# Altium schematic sheet DC-Motor-DRV.SchDoc: DC Motor Driver
size OrCAD A; DocumentNumber: LM-004; Revision: B; SheetNumber: 1; SheetTotal: 4
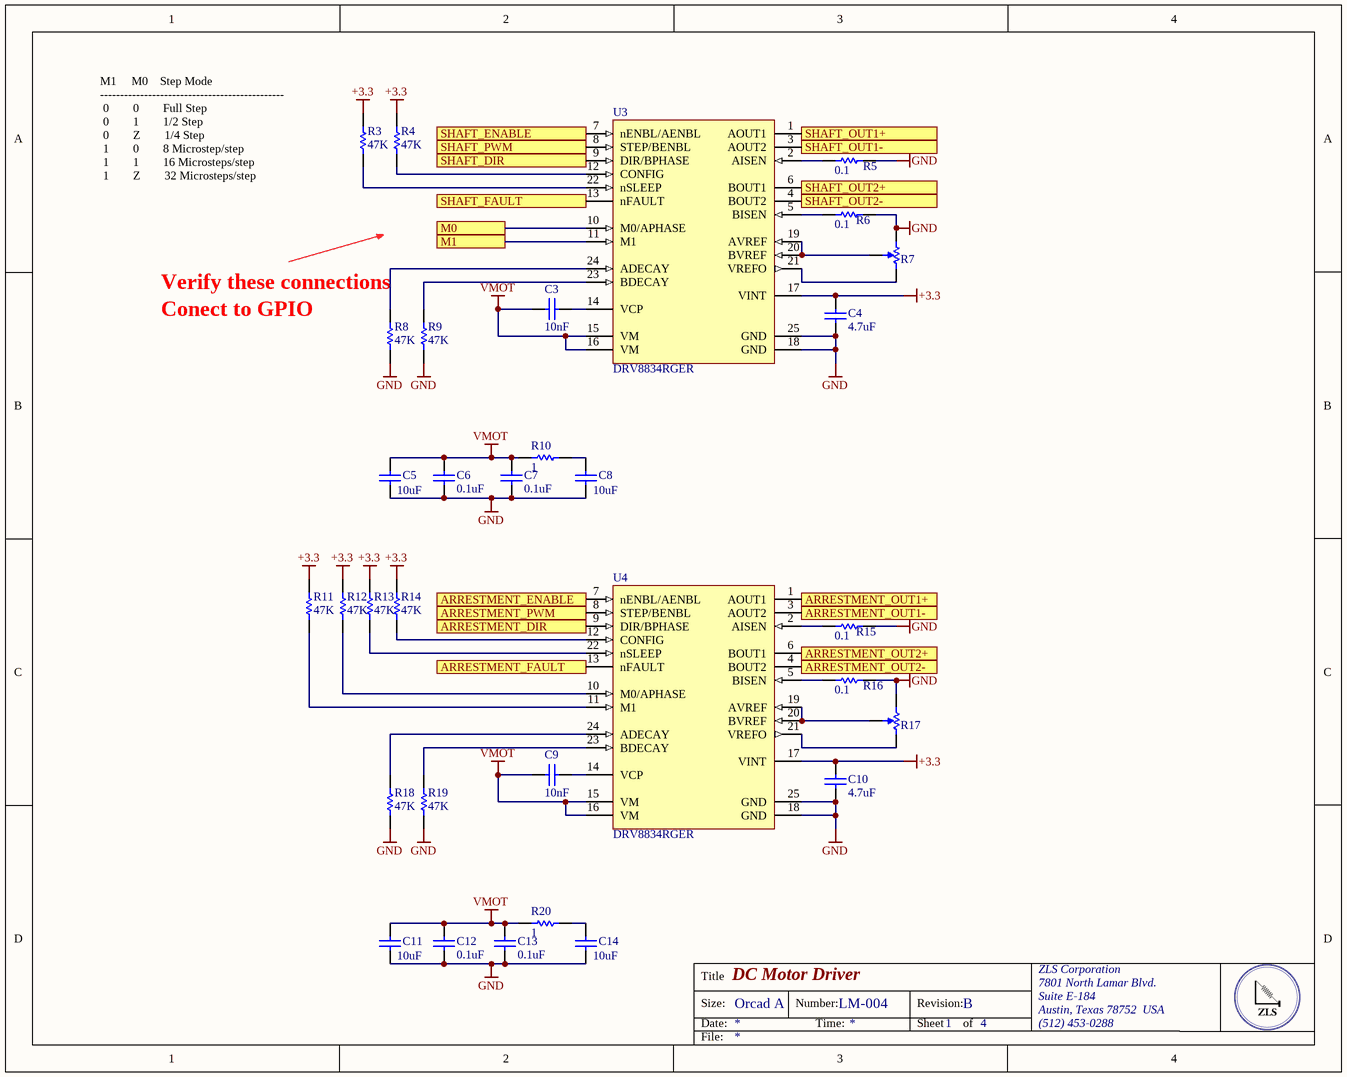
[diagram p0: DC-Motor-DRV.SchDoc]

## Parts
C3  10nF  [CAPC0603(1608)100_L]
C4  4.7uF  [CAPC0603(1608)55_M]
C5  10uF  [CAPC0805(2012)145_N]
C6  0.1uF  [CAPC1608X94X35LL15T15]
C7  0.1uF  [CAPC1608X94X35LL15T15]
C8  10uF  [CAPC0805(2012)145_N]
C9  10nF  [CAPC0603(1608)100_L]
C10  4.7uF  [CAPC0603(1608)55_M]
C11  10uF  [CAPC0805(2012)145_N]
C12  0.1uF  [CAPC1608X94X35LL15T15]
C13  0.1uF  [CAPC1608X94X35LL15T15]
C14  10uF  [CAPC0805(2012)145_N]
R3  47K  [RESC0603(1608)_N]
R4  47K  [RESC0603(1608)_N]
R5  0.1  [RESC0603(1608)_N]
R6  0.1  [RESC0603(1608)_N]
R7  3313J-1-503E  [BOUR-3313J-1_V]  (value not drawn)
R8  47K  [RESC0603(1608)_N]
R9  47K  [RESC0603(1608)_N]
R10  1  [RESC0603(1608)_N]
R11  47K  [RESC0603(1608)_N]
R12  47K  [RESC0603(1608)_N]
R13  47K  [RESC0603(1608)_N]
R14  47K  [RESC0603(1608)_N]
R15  0.1  [RESC0603(1608)_N]
R16  0.1  [RESC0603(1608)_N]
R17  3313J-1-503E  [BOUR-3313J-1_V]  (value not drawn)
R18  47K  [RESC0603(1608)_N]
R19  47K  [RESC0603(1608)_N]
R20  1  [RESC0603(1608)_N]
U3  DRV8834RGER  [RGE0024B_V]
U4  DRV8834RGER  [RGE0024B_V]

## Ports
ARRESTMENT_DIR, ARRESTMENT_ENABLE, ARRESTMENT_FAULT, ARRESTMENT_OUT1+, ARRESTMENT_OUT1-, ARRESTMENT_OUT2+, ARRESTMENT_OUT2-, ARRESTMENT_PWM, M0, M1, SHAFT_DIR, SHAFT_ENABLE, SHAFT_FAULT, SHAFT_OUT1+, SHAFT_OUT1-, SHAFT_OUT2+, SHAFT_OUT2-, SHAFT_PWM

## Nets
+3.3: C4.2 C10.2 R3.2 R4.2 R11.2 R12.2 R13.2 R14.2 U3.17(VINT) U4.17(VINT)
GND: C4.1 C5.1 C6.2 C7.2 C8.1 C10.1 C11.1 C12.2 C13.2 C14.1 R5.2 R6.2 R7.1 R8.1 R9.1 R15.2 R16.2 R17.1 R18.1 R19.1 U3.18(GND) U3.25(GND) U4.18(GND) U4.25(GND)
VMOT: C3.1 C5.2 C6.1 C7.1 C9.1 C11.2 C12.1 C13.1 R10.2 R20.2 U3.15(VM) U3.16(VM) U4.15(VM) U4.16(VM)
ARRESTMENT_DIR: U4.9(DIR/BPHASE) ; port ARRESTMENT_DIR
ARRESTMENT_ENABLE: U4.7(nENBL/AENBL) ; port ARRESTMENT_ENABLE
ARRESTMENT_FAULT: U4.13(nFAULT) ; port ARRESTMENT_FAULT
ARRESTMENT_OUT1+: U4.1(AOUT1) ; port ARRESTMENT_OUT1+
ARRESTMENT_OUT1-: U4.3(AOUT2) ; port ARRESTMENT_OUT1-
ARRESTMENT_OUT2+: U4.6(BOUT1) ; port ARRESTMENT_OUT2+
ARRESTMENT_OUT2-: U4.4(BOUT2) ; port ARRESTMENT_OUT2-
ARRESTMENT_PWM: U4.8(STEP/BENBL) ; port ARRESTMENT_PWM
M0: U3.10(M0/APHASE) ; port M0
M1: U3.11(M1) ; port M1
SHAFT_DIR: U3.9(DIR/BPHASE) ; port SHAFT_DIR
SHAFT_ENABLE: U3.7(nENBL/AENBL) ; port SHAFT_ENABLE
SHAFT_FAULT: U3.13(nFAULT) ; port SHAFT_FAULT
SHAFT_OUT1+: U3.1(AOUT1) ; port SHAFT_OUT1+
SHAFT_OUT1-: U3.3(AOUT2) ; port SHAFT_OUT1-
SHAFT_OUT2+: U3.6(BOUT1) ; port SHAFT_OUT2+
SHAFT_OUT2-: U3.4(BOUT2) ; port SHAFT_OUT2-
SHAFT_PWM: U3.8(STEP/BENBL) ; port SHAFT_PWM
NetC3_2: C3.2 U3.14(VCP)
NetC8_2: C8.2 R10.1
NetC9_2: C9.2 U4.14(VCP)
NetC14_2: C14.2 R20.1
NetR3_1: R3.1 U3.22(nSLEEP)
NetR4_1: R4.1 U3.12(CONFIG)
NetR5_1: R5.1 U3.2(AISEN)
NetR6_1: R6.1 U3.5(BISEN)
NetR7_2: R7.2 U3.19(AVREF) U3.20(BVREF)
NetR7_3: R7.3 U3.21(VREFO)
NetR8_2: R8.2 U3.24(ADECAY)
NetR9_2: R9.2 U3.23(BDECAY)
NetR11_1: R11.1 U4.11(M1)
NetR12_1: R12.1 U4.10(M0/APHASE)
NetR13_1: R13.1 U4.22(nSLEEP)
NetR14_1: R14.1 U4.12(CONFIG)
NetR15_1: R15.1 U4.2(AISEN)
NetR16_1: R16.1 U4.5(BISEN)
NetR17_2: R17.2 U4.19(AVREF) U4.20(BVREF)
NetR17_3: R17.3 U4.21(VREFO)
NetR18_2: R18.2 U4.24(ADECAY)
NetR19_2: R19.2 U4.23(BDECAY)

## Notes on the sheet
- M1     M0    Step Mode
  ----------------------------------------------
  0        0        Full Step
  0        1        1/2 Step
  0        Z        1/4 Step
  1        0        8 Microstep/step
  1        1        16 Microsteps/step
  1        Z        32 Microsteps/step
- Verify these connections
- Conect to GPIO
- Title
- Size:
- Date:
- Orcad A
- Number:
- Time:
- Revision:
- Sheet
- of
- ZLS Corporation
- 7801 North Lamar Blvd.
- Suite E-184
- Austin, Texas 78752  USA
- (512) 453-0288
- File:

## Library data of the parts
C3 C9 = CMP-1035-02312-1: CAP 10nF 16V ±20% 0603 (1608 Metric) Thickness 1mm SMD; Manufacturer: Kyocera AVX; Manufacturer Part Number: 0603YC103KAT2A; Case-EIA: 0603; Tolerance: Â±20%; Case-Metric: 1608; Dielectric: X7R; Dissipation Factor: 3.5%; Max Thickness: 1 mm; Value: 10nF; Technology: SMT; Rated Voltage: 16 V; Supplier 1: Digi-Key; Supplier Part Number 1: 478-6209-6-ND; Stock 1: 132527; Pricing 1: 1=0.19, 10=0.133, 100=0.0625, 500=0.04384, 1000=0.0363 (USD); Mount: Surface Mount; Case/Package: 0603; Case Code (Metric): 1608; Case Code (Imperial): 0603; Min Operating Temperature: -55°C; Max Operating Temperature: 125°C; Capacitance: 10nF; Packaging: Tape and Reel; Voltage Rating (DC): 16V; Voltage Rating: 16V; Package Quantity: 1; Termination: SMD/SMT; Voltage: 16V; Length: 1.6mm; Width: 0.032inch; Thickness: 0.035inch; Depth: 0.81mm; Radiation Hardening: No; REACH SVHC: No SVHC; Lead Free: Lead Free; ComponentLink1URL: http://catalogs.avx.com/SurfaceMount.pdf; ComponentLink1Description: http://catalogs.avx.com/SurfaceMount.pdf; ComponentLink2URL: http://www.farnell.com/datasheets/1679506.pdf; ComponentLink2Description: http://www.farnell.com/datasheets/1679506.pdf; ComponentLink3URL: http://www.mouser.com/ds/2/40/X7RDielectric-777024.pdf; ComponentLink3Description: http://www.mouser.com/ds/2/40/X7RDielectric-777024.pdf; ComponentLink4URL: http://www.avx.com/docs/Catalogs/cx7r.pdf; ComponentLink4Description: http://www.avx.com/docs/Catalogs/cx7r.pdf
C4 C10 = CMP-1035-02779-1: CAP 4.7uF 6.3V ±10% 0603 (1608 Metric) Thickness 0.55mm SMD; Manufacturer: KEMET; Manufacturer Part Number: C0603C475K9PACTU; Case-EIA: 0603; Tolerance: Â±10%; Case-Metric: 1608; Dielectric Material: Ceramic; Dielectric: X5R; Dissipation Factor: 5%; Technology: SMT; Value: 4.7uF; Max Thickness: 0.55 mm; Rated Voltage: 6.3 V; Supplier 1: Digi-Key; Supplier Part Number 1: 399-3482-6-ND; Stock 1: 1765509; Pricing 1: 1=0.21, 10=0.15, 100=0.0706, 500=0.04952, 1000=0.041 (USD); Mount: PCB,Surface Mount; Case/Package: 0603; Number of Pins: 2; Case Code (Metric): 1608; Case Code (Imperial): 0603; Contact Plating: Matte,Tin; Min Operating Temperature: -55°C; Max Operating Temperature: 85°C; Package Quantity: 1; Capacitance: 4.7uF; Voltage Rating: 6.3V; Packaging: Tape and Reel; Termination: SMD/SMT; Voltage Rating (DC): 6.3V; Voltage: 6.3V; Length: 1.6mm; Height: 0.8mm; Width: 0.031inch; Thickness: 0.035inch; Depth: 0.8mm; Lead Pitch: 0.7mm; Radiation Hardening: No; Lead Free: Lead Free; REACH SVHC: No SVHC; ComponentLink1URL: https://api.kemet.com/component-edge/download/datasheet/C0603C475K9PACTU.pdf; ComponentLink1Description: https://api.kemet.com/component-edge/download/datasheet/C0603C475K9PACTU.pdf; ComponentLink2URL: http://www.farnell.com/datasheets/1732700.pdf; ComponentLink2Description: http://www.farnell.com/datasheets/1732700.pdf; ComponentLink3URL: http://www.farnell.com/datasheets/1789732.pdf; ComponentLink3Description: http://www.farnell.com/datasheets/1789732.pdf; ComponentLink4URL: http://www.farnell.com/datasheets/40889.pdf; ComponentLink4Description: http://www.farnell.com/datasheets/40889.pdf
C5 C8 C11 C14 = CMP-1036-04795-1: CAP CER 0.1UF 25V X7R 0805; Manufacturer: Murata Electronics North America; Manufacturer Part Number: GRM21BR71E104KA01L; Capacitance: 0.1µF; Tolerance: ±10%; Supplier 1: Digi-Key; Supplier Part Number 1: 490-1673-6-ND; RoHS: RoHS Compliant; Category: Capacitors; Stock 1: 891652; Pricing 1: 1=0.2, 10=0.145, 100=0.0683, 500=0.04788, 1000=0.03964 (USD); Packaging: Digi-Reel®; Part Status: Active; Voltage - Rated: 25V; Temperature Coefficient: X7R; Operating Temperature: -55°C ~ 125°C; Features: -; Ratings: -; Applications: General Purpose; Mounting Type: Surface Mount, MLCC; Package / Case: 0805 (2012 Metric); Size / Dimension: 0.079" L x 0.049" W (2.00mm x 1.25mm); Height - Seated (Max): -; Thickness (Max): 0.053" (1.35mm); Lead Spacing: -; Lead Style: -; ComponentLink1URL: http://www.murata.com/~/media/webrenewal/support/library/catalog/products/capacitor/mlcc/c02e.ashx; ComponentLink1Description: http://www.murata.com/~/media/webrenewal/support/library/catalog/products/capacitor/mlcc/c02e.ashx
C6 C7 C12 C13 = CMP-1661-00001-2: CAP .1UF 16V CERAMIC X7R 0603; Manufacturer: Yageo; Manufacturer Part Number: CC0603KRX7R7BB105; Capacitance: 1uF; Tolerance: 10%; Dissipation Factor: 5%; ComponentLink1Description: Datasheet; ComponentLink1URL: http://datasheets.avx.com/X7RDielectric.pdf; Supplier 1: Digi-Key; Supplier Part Number 1: 311-1446-6-ND; Stock 1: 5506121; Pricing 1: 1=0.21, 10=0.143, 100=0.0727, 500=0.04974, 1000=0.044 (USD); Mount: Surface Mount; Case/Package: 0603; Number of Pins: 2; Case Code (Metric): 1608; Case Code (Imperial): 0603; Min Operating Temperature: -55°C; Max Operating Temperature: 125°C; Voltage Rating: 16V; Package Quantity: 1; Packaging: Tape and Reel; Voltage Rating (DC): 16V; Dielectric: X7R; Termination: SMD/SMT; Voltage: 16V; Composition: Ceramic; Length: 1.6mm; Height: 0.8mm; Width: 0.031inch; Thickness: 0.035inch; Depth: 0.8mm; Radiation Hardening: No; REACH SVHC: Unknown; Lead Free: Lead Free; Halogen Free: Halogen Free; ComponentLink2URL: http://www.yageo.com/documents/recent/UPY-GPHC_X7R_6.3V-to-50V_18.pdf; ComponentLink2Description: http://www.yageo.com/documents/recent/UPY-GPHC_X7R_6.3V-to-50V_18.pdf; ComponentLink3URL: http://www.yageo.com/documents/recent/UPY-GPHC_X7R_6.3V-to-50V_8.pdf; ComponentLink3Description: http://www.yageo.com/documents/recent/UPY-GPHC_X7R_6.3V-to-50V_8.pdf; ComponentLink4URL: http://www.farnell.com/datasheets/1734573.pdf; ComponentLink4Description: http://www.farnell.com/datasheets/1734573.pdf; ComponentLink5URL: http://www.farnell.com/datasheets/1489800.pdf; ComponentLink5Description: http://www.farnell.com/datasheets/1489800.pdf
R3 R4 R8 R9 R11-R14 R18 R19 = CMP-1012-00511-1: RES SMD 10K OHM 1% 1/10W 0603; Manufacturer: Vishay; Manufacturer Part Number: CRCW060310K0FKEA; Resistance: 10kR; Power Rating: 100mW; Voltage Rating: 75V; Temperature Coefficient: 100ppm/°C; ComponentLink1URL: http://www.vishay.com/docs/20008/dcrcw.pdf; ComponentLink1Description: http://www.vishay.com/docs/20008/dcrcw.pdf; ComponentLink2URL: https://www.verical.com/server-webapp/html/getDatasheet?partID=86831; ComponentLink2Description: https://www.verical.com/server-webapp/html/getDatasheet?partID=86831; ComponentLink3URL: http://www.farnell.com/datasheets/2310790.pdf; ComponentLink3Description: http://www.farnell.com/datasheets/2310790.pdf; ComponentLink4URL: http://www.vishay.com/docs/20035/dcrcwe3.pdf; ComponentLink4Description: http://www.vishay.com/docs/20035/dcrcwe3.pdf; ComponentLink5URL: http://www.farnell.com/datasheets/2111203.pdf; ComponentLink5Description: http://www.farnell.com/datasheets/2111203.pdf; ComponentLink6URL: http://uk.rs-online.com/webdocs/0d98/0900766b80d98afc.pdf; ComponentLink6Description: http://uk.rs-online.com/webdocs/0d98/0900766b80d98afc.pdf; Supplier 1: Digi-Key; Supplier Part Number 1: 311-0.0GRDKR-ND; Stock 1: 49641653; Pricing 1: 1=0.1, 10=0.021, 25=0.0152, 50=0.0114, 100=0.0084, 250=0.00644, 500=0.00514, 1000=0.00379 (USD); Case/Package: 0603; Number of Pins: 2; Weight: 7.1E-05oz; Case Code (Metric): 1608; Case Code (Imperial): 0603; Contact Plating: Lead,Tin; Min Operating Temperature: -55°C; Max Operating Temperature: 155°C; Tolerance: 1%; Packaging: Tape and Reel; Composition: Thick Film; Termination: SMD/SMT; Military Standard: Not; Voltage Rating (DC): 75V; Package Quantity: 10; Number of Terminations: 2; Max Power Dissipation: 100mW; Features: Automotive AEC-Q200; Length: 1.55mm; Height: 0.45mm; Depth: 0.85mm; Width: 0.033inch; Radiation Hardening: No; REACH SVHC: Unknown; Lead Free: Lead Free
R5 R6 R15 R16 = CMP-1012-00511-1: 0R12 0.1W 1% 0603 (1608 Metric)  SMD; Manufacturer: Vishay; Manufacturer Part Number: CRCW060310K0FKEA; Value: 1020.00 Ohm; Case-EIA: 0603; Case-Metric: 1608; Resistance: 10kR; Power Rating: 100mW; Voltage Rating: 75V; Temperature Coefficient: 100ppm/°C; Technology: SMT; Power: 0.1 W; Tolerance: 1 %; Supplier 1: Digi-Key; Supplier Part Number 1: 311-0.0GRDKR-ND; Stock 1: 49641653; Pricing 1: 1=0.1, 10=0.021, 25=0.0152, 50=0.0114, 100=0.0084, 250=0.00644, 500=0.00514, 1000=0.00379 (USD); Case/Package: 0603; Number of Pins: 2; Weight: 7.1E-05oz; Case Code (Metric): 1608; Case Code (Imperial): 0603; Contact Plating: Lead,Tin; Min Operating Temperature: -55°C; Max Operating Temperature: 155°C; Packaging: Tape and Reel; Package Quantity: 10; Composition: Thick Film; Military Standard: Not; Termination: SMD/SMT; Voltage Rating (DC): 75V; Number of Terminations: 2; Max Power Dissipation: 100mW; Features: Automotive AEC-Q200; Length: 1.55mm; Height: 0.45mm; Width: 0.033inch; Depth: 0.85mm; Radiation Hardening: No; REACH SVHC: Unknown; Lead Free: Lead Free; ComponentLink1URL: http://www.vishay.com/docs/20008/dcrcw.pdf; ComponentLink1Description: http://www.vishay.com/docs/20008/dcrcw.pdf; ComponentLink2URL: https://www.verical.com/server-webapp/html/getDatasheet?partID=86831; ComponentLink2Description: https://www.verical.com/server-webapp/html/getDatasheet?partID=86831; ComponentLink3URL: http://www.farnell.com/datasheets/2310790.pdf; ComponentLink3Description: http://www.farnell.com/datasheets/2310790.pdf; ComponentLink4URL: http://www.vishay.com/docs/20035/dcrcwe3.pdf; ComponentLink4Description: http://www.vishay.com/docs/20035/dcrcwe3.pdf; ComponentLink5URL: http://www.farnell.com/datasheets/2111203.pdf; ComponentLink5Description: http://www.farnell.com/datasheets/2111203.pdf; ComponentLink6URL: http://uk.rs-online.com/webdocs/0d98/0900766b80d98afc.pdf; ComponentLink6Description: http://uk.rs-online.com/webdocs/0d98/0900766b80d98afc.pdf
R7 R17 = CMP-2000-05588-1: 3 mm Trimpot(R) Trimming Potentiometer, 50 KOhm, +/- 20%, 0.125 W, -55 to 125 degC, 3-Pin SMD, RoHS, Tape and Reel; Manufacturer: Bourns; SVHC: NoSVHC(19-Dec-2012); Temperature Coefficient: ±150ppm/°C; No. of Turns: 1; Power Rating: 125mW; Track Resistance: 50kohm; Manufacturer URL: http://www.bourns.com/; Potentiometer Mounting: SMD; Package Description: 3-Pin Surface Mount Device, Body 3.5 x 3.2 mm, Pitch 1.15 mm; Package Reference: 3313J-1; Mounting Technology: SurfaceMount; Resistance Tolerance: ±20%; Datasheet Version: 05/2016; Datasheet URL: http://www.bourns.com/docs/Product-Datasheets/3313.pdf
R10 R20 = CMP-1012-00511-1: RES SMD 1 OHM 1% 1/10W 0603; Manufacturer: Vishay Dale; Manufacturer Part Number: CRCW06031R00FKEA; Resistance: 1R; Temperature Coefficient: 100ppm/°C; Max Power Dissipation: 100mW; Voltage Rating (DC): 75V; ComponentLink1URL: http://www.vishay.com/docs/20008/dcrcw.pdf; ComponentLink1Description: http://www.vishay.com/docs/20008/dcrcw.pdf; ComponentLink2URL: https://www.verical.com/server-webapp/html/getDatasheet?partID=86831; ComponentLink2Description: https://www.verical.com/server-webapp/html/getDatasheet?partID=86831; ComponentLink3URL: http://www.farnell.com/datasheets/2310790.pdf; ComponentLink3Description: http://www.farnell.com/datasheets/2310790.pdf; ComponentLink4URL: http://www.vishay.com/docs/20035/dcrcwe3.pdf; ComponentLink4Description: http://www.vishay.com/docs/20035/dcrcwe3.pdf; ComponentLink5URL: http://www.farnell.com/datasheets/2111203.pdf; ComponentLink5Description: http://www.farnell.com/datasheets/2111203.pdf; ComponentLink6URL: http://uk.rs-online.com/webdocs/0d98/0900766b80d98afc.pdf; ComponentLink6Description: http://uk.rs-online.com/webdocs/0d98/0900766b80d98afc.pdf; Supplier 1: Digi-Key; Supplier Part Number 1: 541-1.00HHDKR-ND; Stock 1: 1170; Pricing 1: 1=0.1, 10=0.046, 100=0.0187, 1000=0.0084, 2500=0.00729 (USD); Mount: Surface Mount; Case/Package: 0603; Number of Pins: 2; Weight: 7.1E-05oz; Case Code (Metric): 1608; Case Code (Imperial): 0603; Contact Plating: Tin; Min Operating Temperature: -55°C; Max Operating Temperature: 155°C; Tolerance: 1%; Packaging: Tape and Reel; Composition: Thick Film; Number of Terminations: 2; Package Quantity: 10; Power Rating: 100mW; Termination: SMD/SMT; Military Standard: Not; Features: Automotive AEC-Q200; Voltage Rating: 75V; Length: 1.55mm; Height: 0.02inch; Width: 0.033inch; Depth: 0.85mm; Radiation Hardening: No; Lead Free: Lead Free; REACH SVHC: Unknown; ComponentLink7URL: http://www.farnell.com/datasheets/2045673.pdf; ComponentLink7Description: http://www.farnell.com/datasheets/2045673.pdf; ComponentLink8URL: https://www.alliedelec.com/m/d/0c934d6939ccefa68dbe0b96d821c8cf.pdf; ComponentLink8Description: https://www.alliedelec.com/m/d/0c934d6939ccefa68dbe0b96d821c8cf.pdf; ComponentLink9URL: http://www.mouser.com/ds/2/427/dcrcwe3-109170.pdf; ComponentLink9Description: http://www.mouser.com/ds/2/427/dcrcwe3-109170.pdf
U3 U4 = CMP-1685-00004-1: Dual-Bridge Stepper or DC Motor Driver, 2.5 to 10.8 V, -40 to 85 degC, 24-pin QFN (RGE), Green (RoHS & no Sb/Br), Tape and Reel; Min Supply Voltage: 2.5 V; Output Current: 1.5 A; Nominal Supply Current: 4 mA; Max Operating Temperature: 85 degC; Pins: 24; Packaging: Tape and Reel; ComponentLink2Description: Datasheet; ComponentLink2URL: http://www.ti.com/general/docs/lit/getliterature.tsp?genericPartNumber=DRV8834&fileType=pdf; Mounting Technology: Surface Mount; ComponentLink1URL: http://www.ti.com/; Package Quantity: 3000; Mount: Surface Mount; Min Operating Temperature: -40 degC; RoHSCompliant: true; Radiation Hardening: No; PackageDescription: 24-Pin Quad Flat No-lead Package, Body 4 x 4 mm, Pitch 0.5 mm; DatasheetVersion: SLVSB19D, 03/2015; PackageReference: RGE0024B; ComponentLink1Description: Manufacturer URL